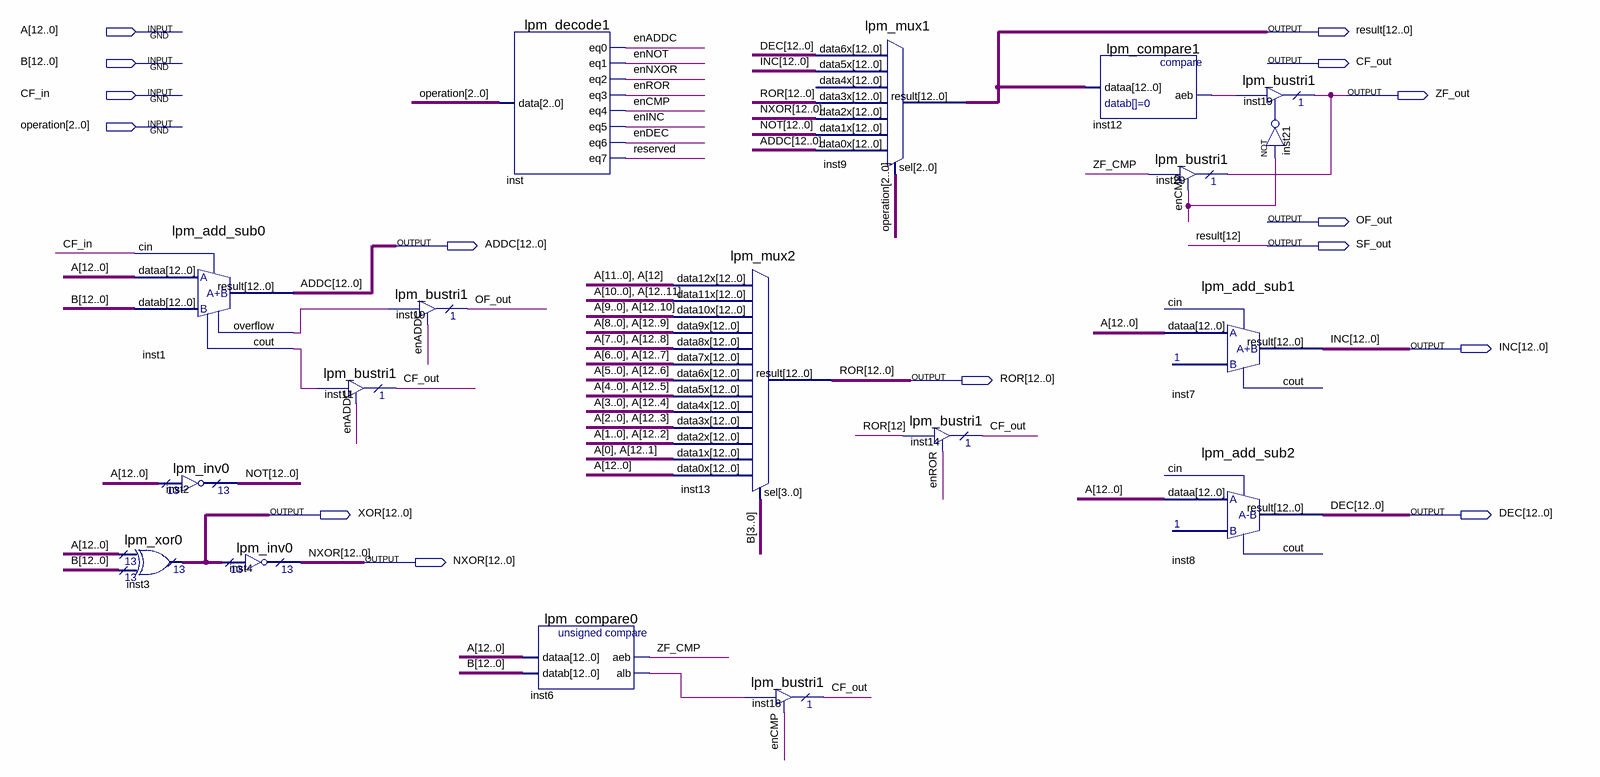
[diagram p0: schematic sheet]
// Quartus schematic ALU.bdf as structural Verilog: 18 symbols, 15 pins
module ALU (
  input  [12:0] A,
  input  [12:0] B,
  input  CF_in,
  input  [2:0] operation,
  output [12:0] result,
  output CF_out,
  output ZF_out,
  output OF_out,
  output [12:0] ADDC,
  output SF_out,
  output [12:0] INC,
  output [12:0] ROR,
  output [12:0] XOR,
  output [12:0] DEC,
  output [12:0] NXOR
);

  wire enADDC, enCMP, enDEC, enINC, enNOT, enNXOR, enROR, inst1_cout, inst1_overflow, inst6_alb, inst12_aeb,
       inst21_out, reserved, ZF_CMP;
  wire [12:0] NOT;

  lpm_xor0 inst3 (.data0x(A), .data1x(B), .result(XOR));
  lpm_add_sub0 inst1 (.dataa(A), .datab(B), .cin(CF_in), .result(ADDC), .overflow(inst1_overflow), .cout(inst1_cout));
  lpm_inv0 inst2 (.data(A), .result(NOT));
  lpm_inv0 inst4 (.data(XOR), .result(NXOR));
  lpm_bustri1 inst11 (.enabledt(enADDC), .data(inst1_cout), .tridata(CF_out));
  lpm_bustri1 inst10 (.enabledt(enADDC), .data(inst1_overflow), .tridata(OF_out));
  lpm_decode1 inst (
    .data(operation), .eq0(enADDC), .eq1(enNOT), .eq2(enNXOR), .eq3(enROR), .eq4(enCMP), .eq5(enINC),
    .eq6(enDEC), .eq7(reserved));
  lpm_compare0 inst6 (.dataa(A), .datab(B), .aeb(ZF_CMP), .alb(inst6_alb));
  lpm_mux2 inst13 (
    .data12x({A[11:0], A[12]}), .data11x({A[10:0], A[12:11]}), .data10x({A[9:0], A[12:10]}),
    .data9x({A[8:0], A[12:9]}), .data8x({A[7:0], A[12:8]}), .data7x({A[6:0], A[12:7]}),
    .data6x({A[5:0], A[12:6]}), .data5x({A[4:0], A[12:5]}), .data4x({A[3:0], A[12:4]}),
    .data3x({A[2:0], A[12:3]}), .data2x({A[1:0], A[12:2]}), .data1x({A[0], A[12:1]}), .data0x(A),
    .sel(B[3:0]), .result(ROR));
  lpm_bustri1 inst18 (.enabledt(enCMP), .data(inst6_alb), .tridata(CF_out));
  lpm_mux1 inst9 (
    .data6x(DEC), .data5x(INC), .data3x(ROR), .data2x(NXOR), .data1x(NOT), .data0x(ADDC), .sel(operation),
    .result(result));  // open: data4x
  lpm_bustri1 inst14 (.enabledt(enROR), .data(ROR[12]), .tridata(CF_out));
  lpm_compare1 inst12 (.dataa(result), .aeb(inst12_aeb));
  lpm_bustri1 inst20 (.enabledt(enCMP), .data(ZF_CMP), .tridata(ZF_out));
  lpm_add_sub1 inst7 (.dataa(A), .result(INC));  // open: cin, cout
  lpm_add_sub2 inst8 (.dataa(A), .result(DEC));  // open: cin, cout
  lpm_bustri1 inst19 (.enabledt(inst21_out), .data(inst12_aeb), .tridata(ZF_out));
  not inst21 (inst21_out, enCMP);

  assign SF_out = result[12];
endmodule
